# EasyEDA schematic 1-Schematic.json
TITLE: nRF24 Scanner; REV: 1.0; Date: 2018-01-01; Sheet: 1/1; Drawn By: tardate
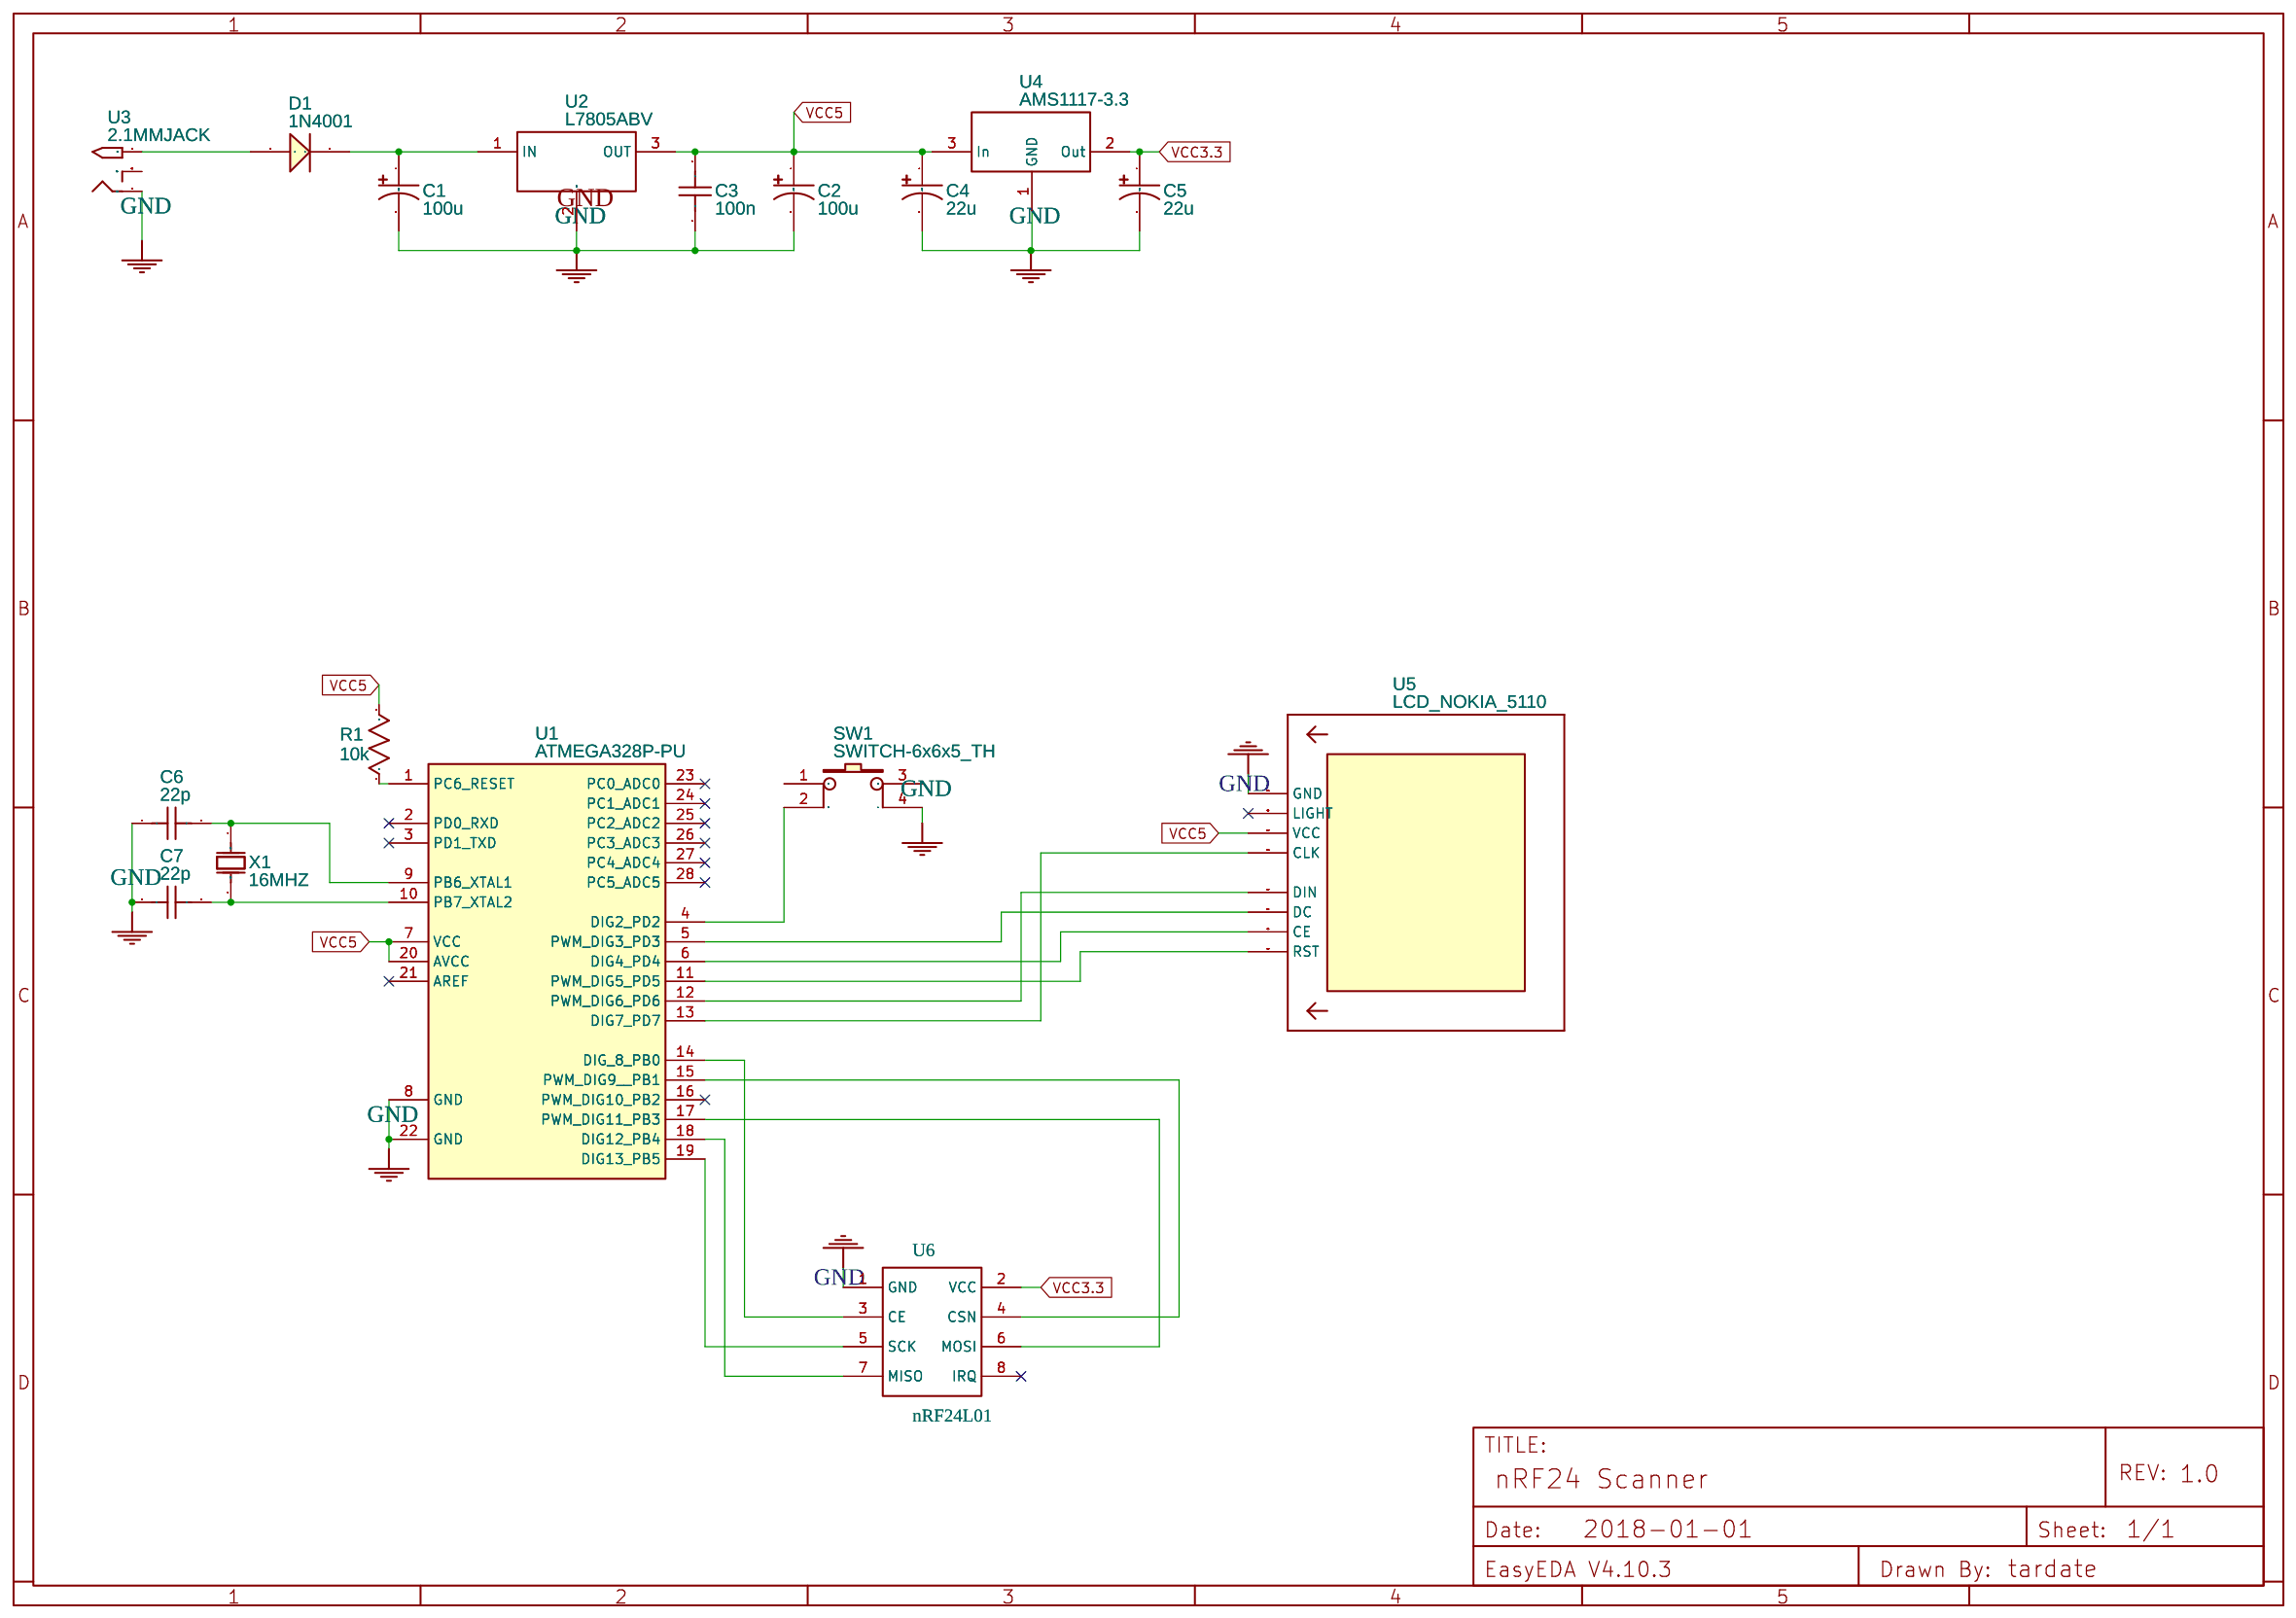
[diagram p0: schematic sheet]

## Parts
C1  100u  [CAP-D3.0XF1.5]
C2  100u  [CAP-D3.0XF1.5]
C3  100n  [RAD-0.1]
C4  22u  [CAP-D3.0XF1.5]
C5  22u  [CAP-D3.0XF1.5]
C6  22p  [RAD-0.1]
C7  22p  [RAD-0.1]
D1  1N4001  [DO-35]
R1  10k  [AXIAL-0.3]
SW1  SWITCH-6x6x5_TH  [SWITCH-6X6X5_TH]
U1  ATMEGA328P-PU  [DIP-28_300MIL]
U2  L7805ABV  [TO-220(TO-220-3)]
U3  2.1MMJACK  [PJ-102A]
U4  AMS1117-3.3  [SOT-223]
U5  LCD_NOKIA_5110  [LCD_NOKIA_5110]
U6  nRF24L01  [NRF24L01+]
X1  16MHZ  [OSC-49S-1]

## Library data of the parts
C1-C7 = Capacitor: Manufacturer Part: ?
D1 = -: LCSC: C14516; Supplier: LCSC; Manufacturer: ST; Manufacturer Part: 1N4148
R1 = Resistor: Manufacturer Part: ?
SW1 = -: LCSC: C69330; Supplier: LCSC; Manufacturer: LCSC
U1 = -: catid: 20; sourceId: Oic6oiASL; Supplier: LCSC; Manufacturer: ATMEL; LCSC: C33901
U2 = -: catid: 20; Supplier: LCSC; Manufacturer: STMicroelectronics; LCSC: C16807
U3 = -: catid: 20; Contributor: Adafruit; Manufacturer Part: ?
U4 = -: sourceId: dwIGgezVh; Supplier: LCSC; Manufacturer: AMS; LCSC: C6186; LCSC Assembly: Yes
U5 = -: catid: 20; Manufacturer Part: ?
X1 = -: LCSC: C16369; Supplier: LCSC; Manufacturer: LCSC; Manufacturer Part: X49SD12MSD2SC

## Nets
GND: C1.2 C2.2 C3.1 C4.2 C5.2 C6.1 C7.1 SW1.4 U1.8(GND) U1.22(GND) U2.2(GND) U3.RING U4.1(GND) U5.P$5 P$13(GND) U6.1(GND)
VCC3.3: C5.1 U4.2(Out) U6.2(VCC)
VCC5: C2.1 C3.2 C4.1 R1.2 U1.7(VCC) U1.20(AVCC) U2.3(OUT) U4.3(In) U5.P$8 P$16(VCC)
Net-(C1-1): C1.1 D1.2(K) U2.1(IN)
Net-(C6-2): C6.2 U1.9(PB6 XTAL1) X1.1(OSC1)
Net-(C7-2): C7.2 U1.10(PB7 XTAL2) X1.2(OSC2)
Net-(D1-1): D1.1(A) U3.TIP
Net-(R1-1): R1.1 U1.1(PC6 RESET)
Net-(SW1-2): SW1.2 U1.4(DIG2 PD2)
Net-(U1-5): U1.5(PWM DIG3 PD3) U5.P$3 P$11(DC)
Net-(U1-6): U1.6(DIG4 PD4) U5.P$1 P$9(CE)
Net-(U1-11): U1.11(PWM DIG5 PD5) U5.P$7 P$15(RST)
Net-(U1-12): U1.12(PWM DIG6 PD6) U5.P$4 P$12(DIN)
Net-(U1-13): U1.13(DIG7 PD7) U5.P$2 P$10(CLK)
Net-(U1-14): U1.14(DIG 8 PB0) U6.3(CE)
Net-(U1-15): U1.15(PWM DIG9  PB1) U6.4(CSN)
Net-(U1-17): U1.17(PWM DIG11 PB3) U6.6(MOSI)
Net-(U1-18): U1.18(DIG12 PB4) U6.7(MISO)
Net-(U1-19): U1.19(DIG13 PB5) U6.5(SCK)

Not connected (* = marked no-connect by the designer): SW1 1 3; U1 2(PD0 RXD)* 3(PD1 TXD)* 16(PWM DIG10 PB2)* 21(AREF)* 23(PC0 ADC0)* 24(PC1 ADC1)* 25(PC2 ADC2)* 26(PC3 ADC3)* 27(PC4 ADC4)* 28(PC5 ADC5)*; U3 RING_SW; U5 P$6 P$14(LIGHT)*; U6 8(IRQ)*
